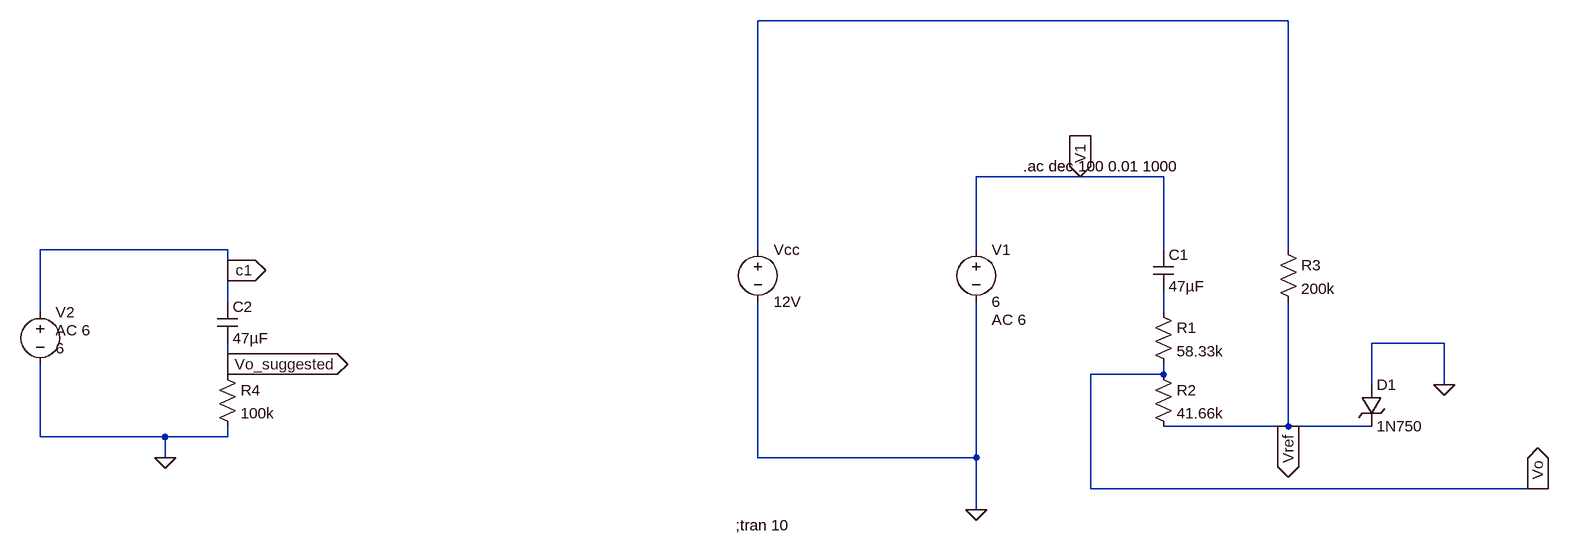
[diagram p0: schematic shift_coupling.asc]
shift_coupling.asc, the LTspice schematic file:
Version 4
SHEET 1 1148 680
WIRE 688 -256 -128 -256
WIRE 368 -16 208 -16
WIRE 496 -16 368 -16
WIRE -944 96 -1232 96
WIRE -128 96 -128 -256
WIRE 208 96 208 -16
WIRE 496 96 496 -16
WIRE 688 96 688 -256
WIRE -944 128 -944 96
WIRE -944 176 -944 128
WIRE -1232 192 -1232 96
WIRE 496 192 496 160
WIRE 928 240 816 240
WIRE -944 272 -944 240
WIRE -944 288 -944 272
WIRE 496 288 496 272
WIRE 496 288 384 288
WIRE 816 304 816 240
WIRE 928 304 928 240
WIRE 688 368 688 176
WIRE 688 368 496 368
WIRE 816 368 688 368
WIRE -1232 384 -1232 272
WIRE -1040 384 -1232 384
WIRE -944 384 -944 368
WIRE -944 384 -1040 384
WIRE -1040 416 -1040 384
WIRE -128 416 -128 176
WIRE 208 416 208 176
WIRE 208 416 -128 416
WIRE 384 464 384 288
WIRE 1072 464 384 464
WIRE 1088 464 1072 464
WIRE 208 496 208 416
FLAG 208 496 0
FLAG 928 304 0
FLAG 1072 464 Vo
IOPIN 1072 464 Out
FLAG 368 -16 V1
IOPIN 368 -16 In
FLAG 688 368 Vref
IOPIN 688 368 Out
FLAG -1040 416 0
FLAG -944 128 c1
IOPIN -944 128 Out
FLAG -944 272 Vo_suggested
IOPIN -944 272 Out
SYMBOL voltage -128 80 R0
SYMATTR InstName Vcc
SYMATTR Value 12V
SYMBOL cap 480 96 R0
SYMATTR InstName C1
SYMATTR Value 47µF
SYMBOL res 480 176 R0
SYMATTR InstName R1
SYMATTR Value 58.33k
SYMBOL res 480 272 R0
SYMATTR InstName R2
SYMATTR Value 41.66k
SYMBOL zener 800 304 R0
SYMATTR InstName D1
SYMATTR Value 1N750
SYMBOL res 672 80 R0
SYMATTR InstName R3
SYMATTR Value 200k
SYMBOL voltage 208 80 R0
WINDOW 123 24 124 Left 2
WINDOW 39 0 0 Left 2
SYMATTR InstName V1
SYMATTR Value 6
SYMATTR Value2 AC 6
SYMBOL voltage -1232 176 R0
WINDOW 123 24 44 Left 2
WINDOW 39 0 0 Left 2
WINDOW 3 24 72 Left 2
SYMATTR Value2 AC 6
SYMATTR InstName V2
SYMATTR Value 6
SYMBOL cap -960 176 R0
SYMATTR InstName C2
SYMATTR Value 47µF
SYMBOL res -960 272 R0
SYMATTR InstName R4
SYMATTR Value 100k
TEXT -162 520 Left 2 !;tran 10
TEXT 280 -32 Left 2 !.ac dec 100 0.01 1000

The netlist it stands for:
* shift_coupling.asc
Vcc N001 0 12V
C1 V1 N002 47µF
R1 N002 Vo 58.33k
R2 Vo Vref 41.66k
D1 0 Vref 1N750
R3 N001 Vref 200k
V1 V1 0 6 AC 6
V2 c1 0 6 AC 6
C2 c1 Vo_suggested 47µF
R4 Vo_suggested 0 100k
.model D D
.lib standard.dio
;tran 10
.ac dec 100 0.01 1000
.backanno
.end